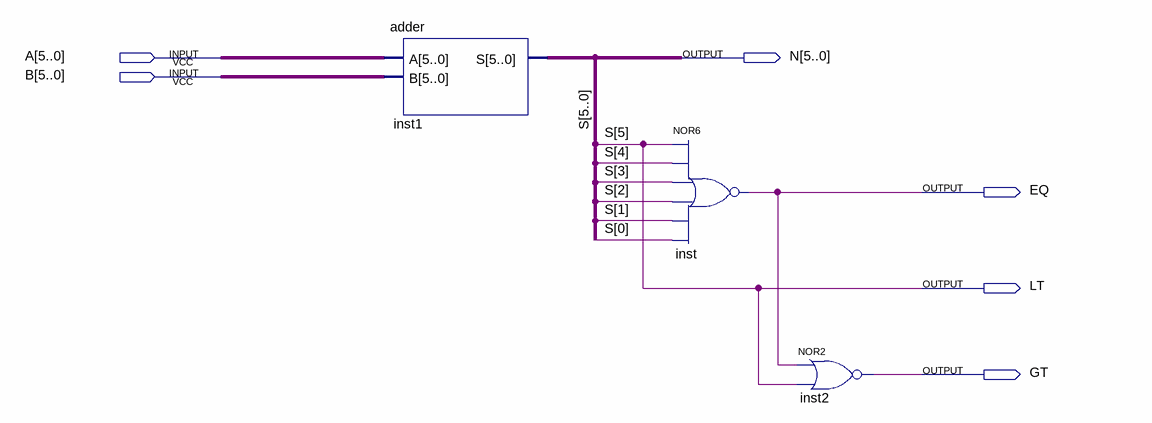
[diagram p0: schematic sheet]
// Quartus schematic arithmetic_unit.bdf as structural Verilog: 3 symbols, 6 pins
module arithmetic_unit (
  input  [5:0] A,
  input  [5:0] B,
  output [5:0] N,
  output EQ,
  output LT,
  output GT
);

  adder inst1 (.A(A), .B(B), .S({LT, N[4:0]}));
  nor inst (EQ, LT, N[4], N[3], N[2], N[1], N[0]);
  nor inst2 (GT, EQ, LT);

  assign N[5] = LT;

  // Other names for the same wires on the sheet: S[5:0] = {LT, N[4:0]}
endmodule
